# Altium schematic sheet LEO_COTS_no_siggen_rev0.SchDoc: COTS LEO TX
size A; DocumentNumber: 1; Revision: 1; SheetNumber: 1; SheetTotal: 1
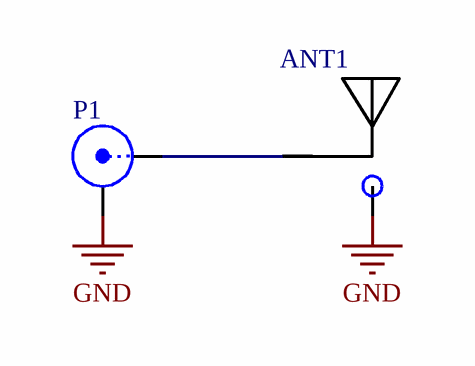
[diagram p0: LEO_COTS_no_siggen_rev0.SchDoc]

## Parts
ANT1  ANT  [RESLOOP_OD10_fw15_fl180_sw12_sl15]  (value not drawn)  (no BOM)
P1  1909763-1  [1909763-1]  (value not drawn)

## Nets
GND: ANT1.2(-) P1.2(Y)
NetANT1_1: ANT1.1(+) P1.1(X)

## Notes on the sheet
- Title
- Size:
- Date:
- A
- Number:
- Time:
- Revision:
- Sheet
- of
- File:

## Library data of the parts
ANT1 = ANT: PCB antenna
P1 = 1909763-1: CONN UMCC JACK STR 50OHM SMD; Supplier 1: Digi-Key; Supplier Part Number 1: A118077CT-ND; Manufacturer Part Number: 1909763-1